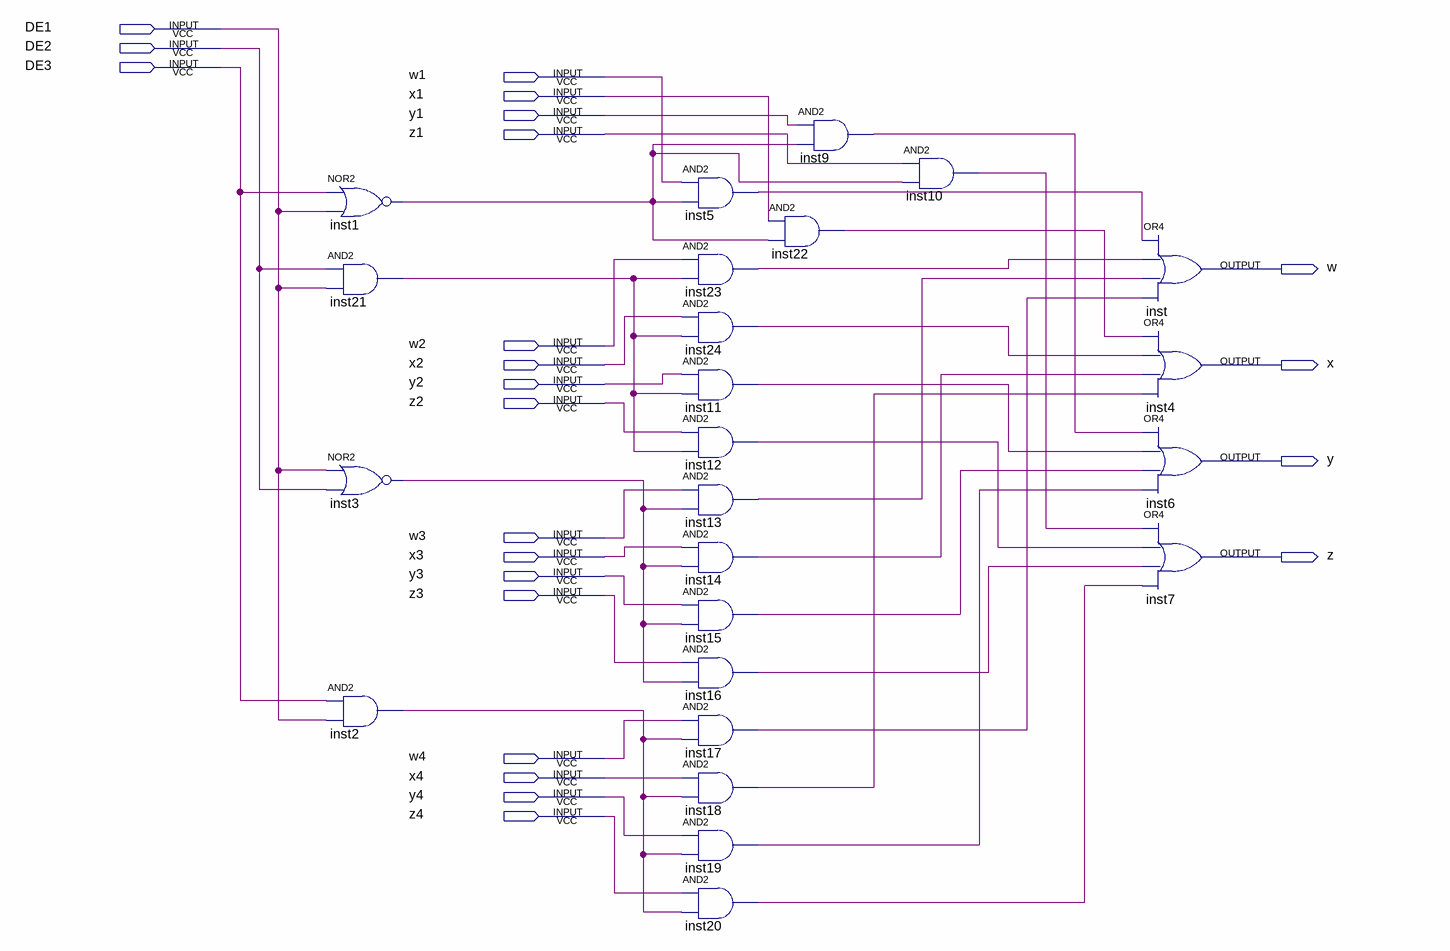
[diagram p0: schematic sheet]
// Quartus schematic display_digi.bdf as structural Verilog: 24 symbols, 23 pins
module display_digi (
  input  DE1,
  input  DE2,
  input  DE3,
  input  w1,
  input  x1,
  input  y1,
  input  z1,
  input  w2,
  input  x2,
  input  y2,
  input  z2,
  input  w3,
  input  x3,
  input  y3,
  input  z3,
  input  w4,
  input  x4,
  input  y4,
  input  z4,
  output w,
  output x,
  output y,
  output z
);

  wire inst1_out, inst2_out, inst3_out, inst5_out, inst9_out, inst10_out, inst11_out, inst12_out, inst13_out,
       inst14_out, inst15_out, inst16_out, inst17_out, inst18_out, inst19_out, inst20_out, inst21_out,
       inst22_out, inst23_out, inst24_out;

  nor inst1 (inst1_out, DE3, DE1);
  and inst21 (inst21_out, DE2, DE1);
  nor inst3 (inst3_out, DE1, DE2);
  and inst2 (inst2_out, DE3, DE1);
  and inst5 (inst5_out, w1, inst1_out);
  and inst23 (inst23_out, w2, inst21_out);
  and inst24 (inst24_out, x2, inst21_out);
  and inst11 (inst11_out, y2, inst21_out);
  and inst12 (inst12_out, z2, inst21_out);
  and inst13 (inst13_out, w3, inst3_out);
  and inst14 (inst14_out, x3, inst3_out);
  and inst15 (inst15_out, y3, inst3_out);
  and inst16 (inst16_out, z3, inst3_out);
  and inst17 (inst17_out, w4, inst2_out);
  and inst18 (inst18_out, x4, inst2_out);
  and inst19 (inst19_out, y4, inst2_out);
  and inst20 (inst20_out, z4, inst2_out);
  and inst22 (inst22_out, x1, inst1_out);
  and inst9 (inst9_out, y1, inst1_out);
  and inst10 (inst10_out, z1, inst1_out);
  or inst (w, inst5_out, inst23_out, inst13_out, inst17_out);
  or inst4 (x, inst22_out, inst24_out, inst14_out, inst18_out);
  or inst6 (y, inst9_out, inst11_out, inst15_out, inst19_out);
  or inst7 (z, inst10_out, inst12_out, inst16_out, inst20_out);
endmodule
